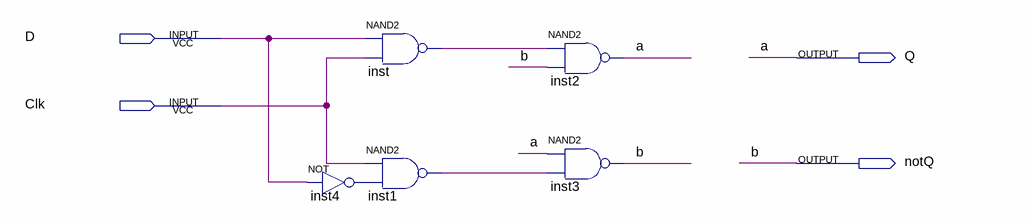
[diagram p0: schematic sheet]
// Quartus schematic D_Latch.bdf as structural Verilog: 5 symbols, 4 pins
module D_Latch (
  input  D,
  input  Clk,
  output Q,
  output notQ
);

  wire inst1_out, inst4_out, inst_out;

  not inst4 (inst4_out, D);
  nand inst (inst_out, D, Clk);
  nand inst1 (inst1_out, Clk, inst4_out);
  nand inst2 (Q, inst_out, notQ);
  nand inst3 (notQ, Q, inst1_out);

  // Other names for the same wires on the sheet: a = Q; b = notQ
endmodule
